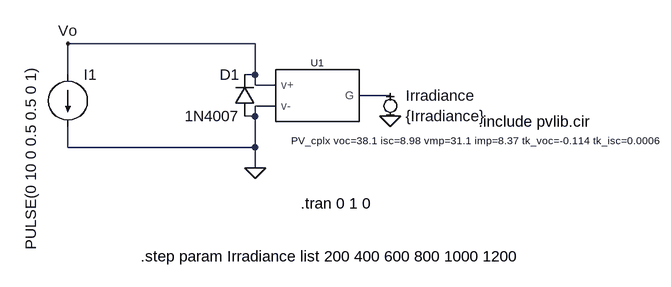
[diagram p0: schematic testing_pvlib.asc]
testing_pvlib.asc, the LTspice schematic file:
Version 4
SHEET 1 976 680
WIRE 80 48 -208 48
WIRE -208 96 -208 48
WIRE 80 96 80 48
WIRE 80 96 64 96
WIRE 80 112 80 96
WIRE 112 112 80 112
WIRE 288 128 240 128
WIRE 112 144 80 144
WIRE 80 160 80 144
WIRE 80 160 64 160
WIRE -208 208 -208 176
WIRE 80 208 80 160
WIRE 80 208 -208 208
WIRE 80 240 80 208
FLAG 288 160 0
FLAG 80 240 0
FLAG -208 48 Vo
SYMBOL PV_cplx 176 128 R0
WINDOW 3 236 59 Top 1
SYMATTR InstName U1
SYMATTR Value PV_cplx voc=38.1 isc=8.98 vmp=31.1 imp=8.37 tk_voc=-0.114 tk_isc=0.0006
SYMBOL MiniSyms4\\voltage- 288 144 R0
WINDOW 123 0 0 Left 0
WINDOW 39 0 0 Left 0
SYMATTR InstName Irradiance
SYMATTR Value {Irradiance}
SYMBOL current -208 96 R0
WINDOW 3 -57 -13 VRight 2
WINDOW 123 0 0 Left 0
WINDOW 39 0 0 Left 0
SYMATTR InstName I1
SYMATTR Value PULSE(0 10 0 0.5 0.5 0 1)
SYMBOL diode 80 160 R180
WINDOW 0 24 64 Left 2
WINDOW 3 24 0 Left 2
SYMATTR InstName D1
SYMATTR Value 1N4007
TEXT 150 294 Left 2 !.tran 0 1 0
TEXT 424 168 Left 2 !.include pvlib.cir
TEXT -96 376 Left 2 !.step param Irradiance list 200 400 600 800 1000 1200

The netlist it stands for:
* testing_pvlib.asc
XU1 Vo 0 N001 PV_cplx voc=38.1 isc=8.98 vmp=31.1 imp=8.37 tk_voc=-0.114 tk_isc=0.0006  ; pins v+ v- G
V§Irradiance N001 0 {Irradiance}
I1 Vo 0 PULSE(0 10 0 0.5 0.5 0 1)
D1 0 Vo 1N4007
.model D D
.lib standard.dio
.tran 0 1 0
.include pvlib.cir
.step param Irradiance list 200 400 600 800 1000 1200
.lib C:\users\joaoantoniocardoso\Favorites\ZeniteSolar\2022\MCC22\design\modelling\simulations_ltspice\pvlib.cir
.backanno
.end